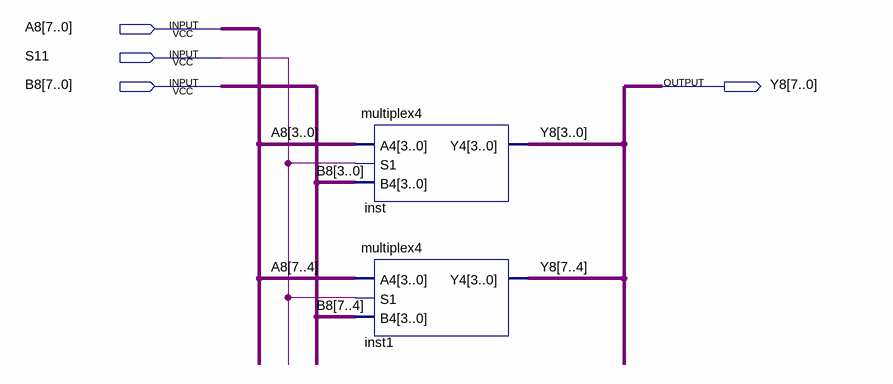
[diagram p0: schematic sheet]
// Quartus schematic multiplex8.bdf as structural Verilog: 2 symbols, 4 pins
module multiplex8 (
  input  [7:0] A8,
  input  S11,
  input  [7:0] B8,
  output [7:0] Y8
);

  multiplex4 inst (.A4(A8[3:0]), .S1(S11), .B4(B8[3:0]), .Y4(Y8[3:0]));
  multiplex4 inst1 (.A4(A8[7:4]), .S1(S11), .B4(B8[7:4]), .Y4(Y8[7:4]));
endmodule
